# EAGLE schematic wireless-ac-motor-controller-mk-1.2 (EAGLE 6.5.0)
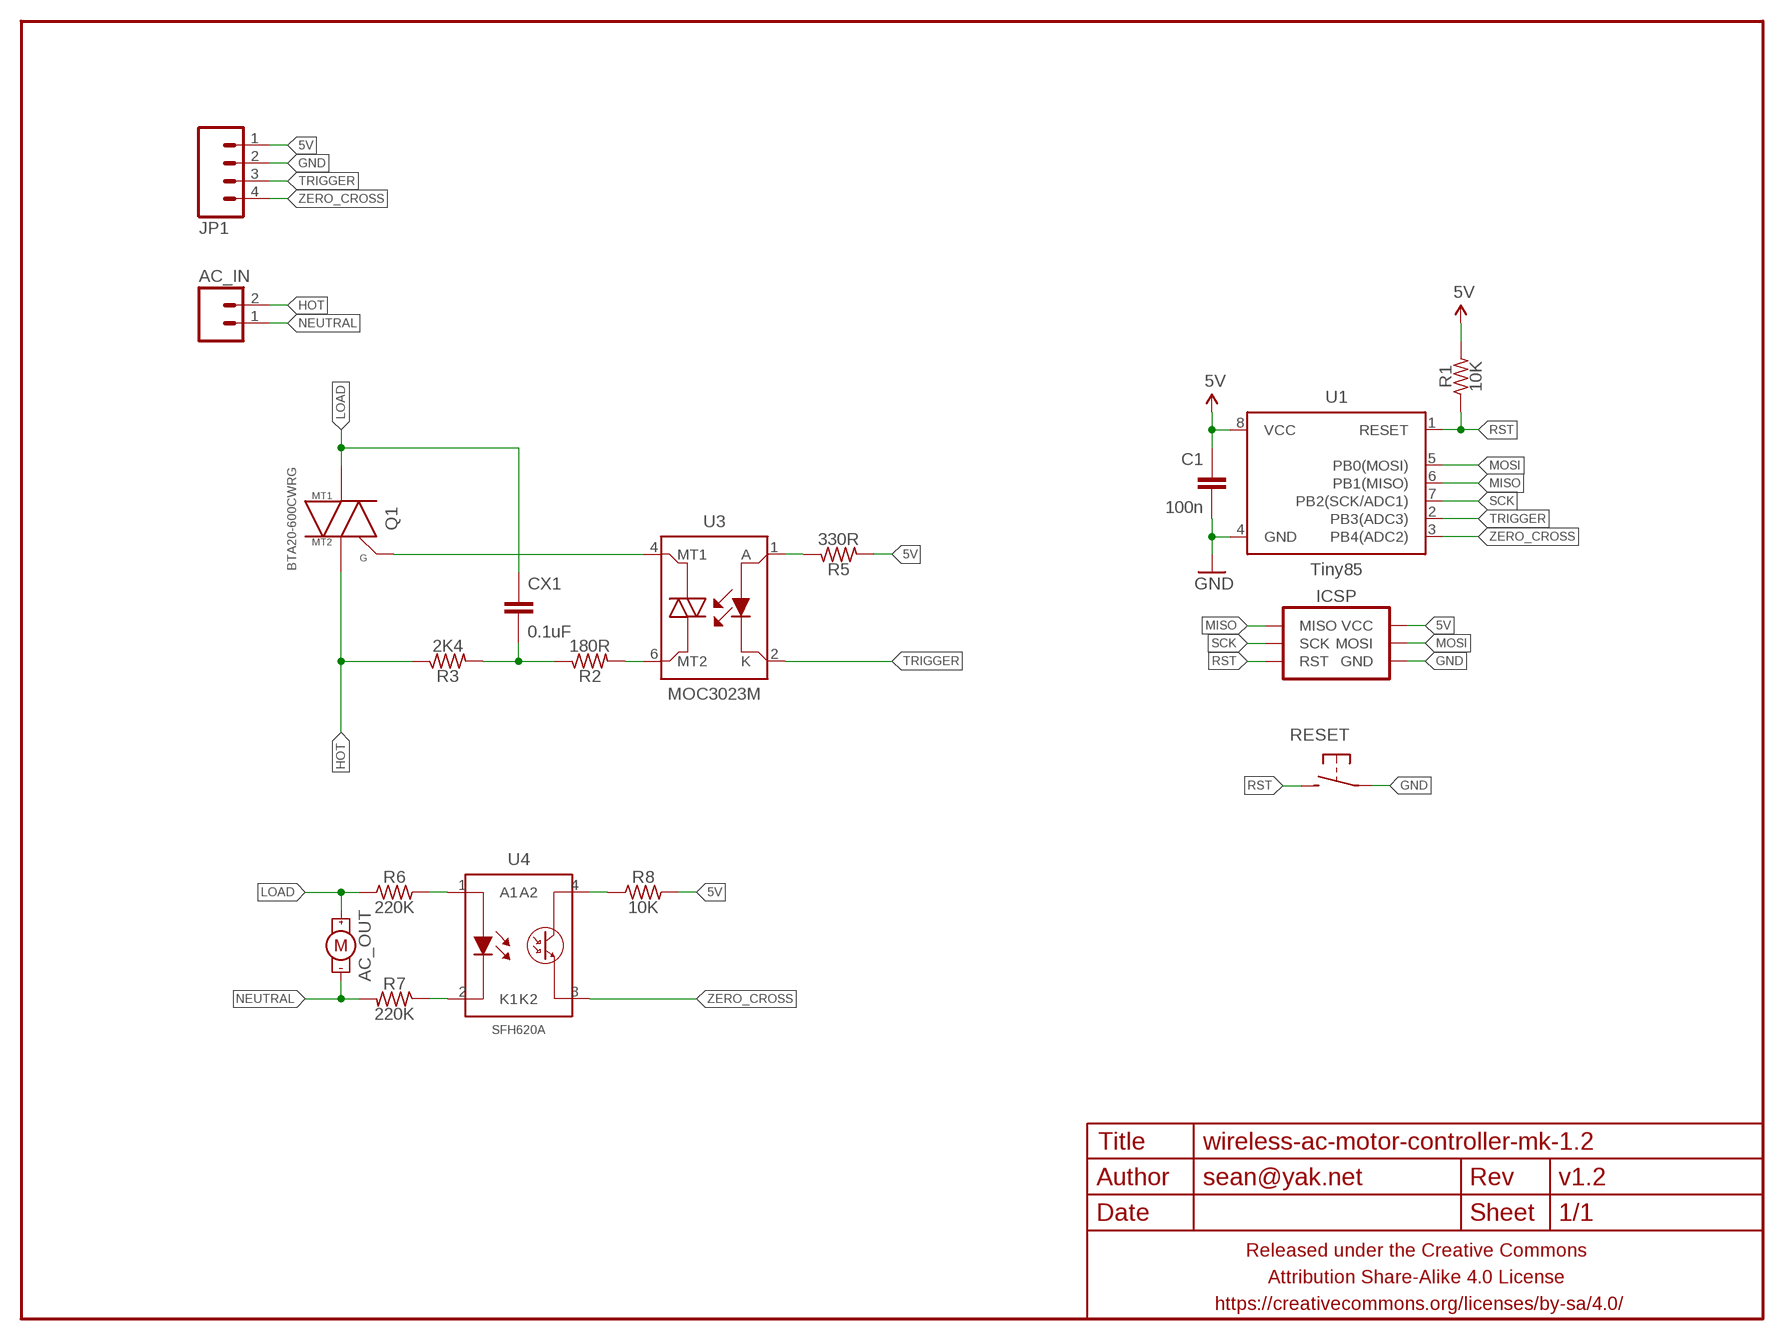
[diagram p0: schematic, sheet 1]

## Parts
AC_IN  SCREWTERMINAL-25MM  [SCREWTERM-5MM-2]
AC_OUT  MOTOR5MM-SCREW-TERM  [1X02_5MM_SCREW]
C1  100n  CAPACITOR-CERAMICC0805  [C0805]
CX1  0.1uF  CXXC10B6  [XC10B6]
FRAME1  FRAME-LETTERNO_PACKAGE  [DUMMY]
ICSP  AVR_SPI_PRG_6PTH  [2X3]
JP1  M04JST-PTH-VERT  [JST-4-PH-VERT-PTH]
Q1  BTA20-600CWRG  TRIACTO-220-VERT  [TO220V]
R1  10K  RESISTORR0805  [R0805]
R2  180R  RESISTORR0805  [R0805]
R3  2K4  RESISTORR0805  [R0805]
R5  330R  RESISTORR0805  [R0805]
R6  220K  RESISTOR0411/3V  [0411V]
R7  220K  RESISTOR0411/3V  [0411V]
R8  10K  RESISTORR0805  [R0805]
RESET  SPST-NO-TACT3MM-PTH-SMALL-PADS  [DTS-3-SMALL-PADS]
U1  Tiny85  ATTINY45TINY85-20-SOICW  [SO08-EIAJ]
U3  MOC3023M  MOC30XXMOC30XXM-DIP6  [DIP06]
U4  SFH620A  OPTOISOLATORDIP4  [DIL04]

## Nets
5V: C1.1 ICSP.2(VCC) JP1.1 R1.2 R5.2 R8.2 U1.8(VCC)
GND: C1.2 ICSP.6(GND) JP1.2 RESET.1 U1.4(GND)
HOT: AC_IN.2 Q1.2(MT2) R3.1
LOAD: AC_OUT.1(+) CX1.1 Q1.1(MT1) R6.1
MISO: ICSP.1(MISO) U1.6(PB1(MISO))
MOSI: ICSP.4(MOSI) U1.5(PB0(MOSI))
N$1: R6.2 U4.1(A1)
N$2: R7.1 U4.2(K1)
N$3: R2.2 U3.6(MT2)
N$4: Q1.3(GATE) U3.4(MT1)
N$5: CX1.2 R2.1 R3.2
N$6: R5.1 U3.1(A)
N$8: R8.1 U4.4(A2)
NEUTRAL: AC_IN.1 AC_OUT.2(-) R7.2
RST: ICSP.5(RST) R1.1 RESET.2 U1.1(RESET)
SCK: ICSP.3(SCK) U1.7(PB2(SCK/ADC1))
TRIGGER: JP1.3 U1.2(PB3(ADC3)) U3.2(K)
ZERO_CROSS: JP1.4 U1.3(PB4(ADC2)) U4.3(K2)

## Library data of the parts
AC_IN = a_parts:SCREWTERMINAL-2
AC_OUT = a_parts:MOTOR: Brushed DC Motor Symbol for a motor combined with screw terminal output pads for hookup (since it's unlikely you're soldering the motor itself to a board :P).
C1 = a_parts:CAPACITOR-CERAMIC: CAPACITOR, European symbol
CX1 = a_parts:CX: X CAPACITOR for power line
FRAME1 = a_parts:FRAME-LETTER: Schematic Frame Standard 8.5x11 US Letter frame; DESIGNER: sean@yak.net; VERSION: v1.2
ICSP = a_parts:AVR_SPI_PRG_6: AVR ISP 6 Pin This is the reduced ISP connector for AVR programming. Common on Arduino. This footprint will take up less PCB space and can be used with a 10-pin to 6-pin adapter such as SKU: BOB-08508 **Special note about "TEST_POINT" package. The stop mask is on the top side, so if you want your programming test points to be on the bottom of your board, make sure to place this package on the bottom side of the board. This also ensure that the orientation to program from the bottom side will be correct.
JP1 = a_parts:M04: Header 4 Standard 4-pin 0.1" header. Use with straight break away headers (SKU : PRT-00116), right angle break away headers (PRT-00553), swiss pins (PRT-00743), machine pins (PRT-00117), and female headers (PRT-00115). Molex polarized connector foot print use with SKU : PRT-08231 with associated crimp pins and housings. 1MM SMD Version SKU: PRT-10208
Q1 = a_parts:TRIAC
R1-R3 R5-R8 = a_parts:RESISTOR: RESISTOR, American symbol
RESET = a_parts:SPST-NO-TACT
U1 = a_parts:ATTINY45: Atmel 8-pin 2/4/8kB flash uC; PROD_ID: IC-09092; VALUE: Tiny85-20-SMT
U3 = a_parts:MOC30XX
U4 = a_parts:OPTOISOLATOR